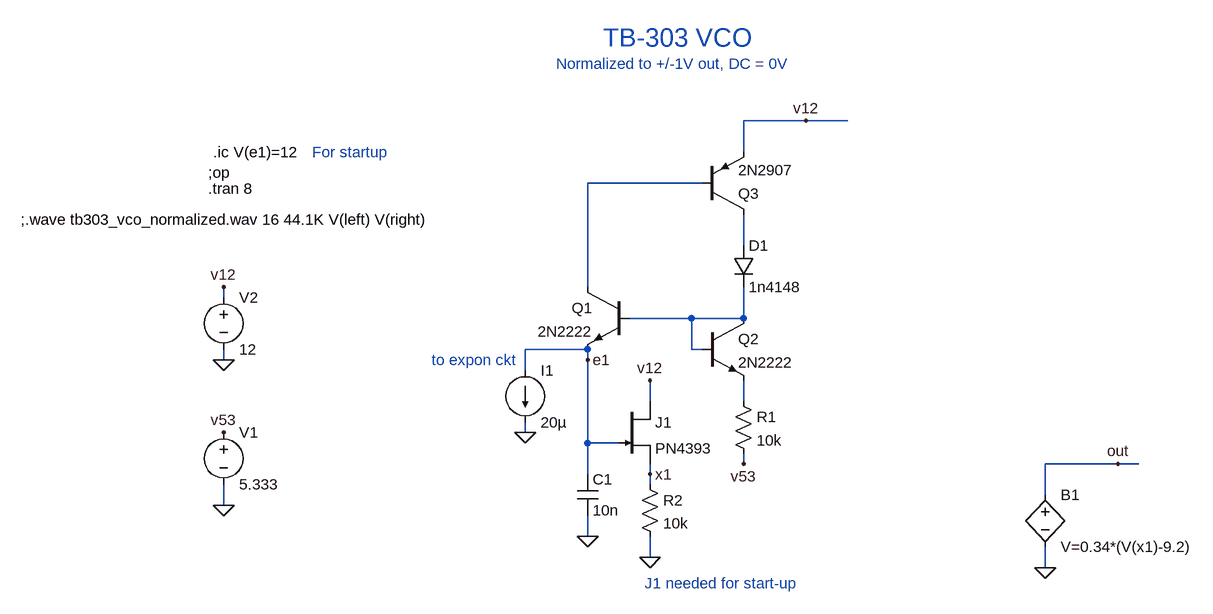
[diagram p0: schematic tb303_vco_normalized.asc]
tb303_vco_normalized.asc, the LTspice schematic file:
Version 4
SHEET 1 1100 1252
WIRE 432 -176 336 -176
WIRE 496 -176 432 -176
WIRE 336 -128 336 -176
WIRE 272 -80 96 -80
WIRE 336 16 336 -32
WIRE 96 80 96 -80
WIRE -464 96 -464 80
WIRE 256 128 160 128
WIRE 336 128 336 80
WIRE 336 128 256 128
WIRE 96 176 0 176
WIRE 256 176 256 128
WIRE 272 176 256 176
WIRE -464 192 -464 176
WIRE 96 192 96 176
WIRE 0 208 0 176
WIRE 192 256 192 224
WIRE 336 256 336 224
WIRE 0 304 0 288
WIRE 96 320 96 192
WIRE 144 320 96 320
WIRE 336 352 336 336
WIRE 912 352 800 352
WIRE 944 352 912 352
WIRE 96 368 96 320
WIRE 192 368 192 352
WIRE 192 384 192 368
WIRE 800 400 800 352
WIRE -464 416 -464 384
WIRE 96 464 96 432
WIRE 192 496 192 464
WIRE 800 512 800 480
FLAG 0 304 0
FLAG -464 416 0
FLAG -464 192 0
FLAG 96 464 0
FLAG 96 192 e1
FLAG 432 -176 v12
FLAG -464 304 v53
FLAG 192 496 0
FLAG 192 224 v12
FLAG 192 368 x1
FLAG -464 80 v12
FLAG 336 352 v53
FLAG 800 512 0
FLAG 912 352 out
SYMBOL current 0 208 R0
WINDOW 123 0 0 Left 2
WINDOW 39 0 0 Left 2
SYMATTR InstName I1
SYMATTR Value 20µ
SYMBOL npn 160 80 M0
SYMATTR InstName Q1
SYMATTR Value 2N2222
SYMBOL npn 272 128 R0
SYMATTR InstName Q2
SYMATTR Value 2N2222
SYMBOL diode 320 16 R0
SYMATTR InstName D1
SYMATTR Value 1n4148
SYMBOL pnp 272 -32 M180
SYMATTR InstName Q3
SYMATTR Value 2N2907
SYMBOL res 320 240 R0
SYMATTR InstName R1
SYMATTR Value 10k
SYMBOL voltage -464 288 R0
SYMATTR InstName V1
SYMATTR Value 5.333
SYMBOL voltage -464 80 R0
SYMATTR InstName V2
SYMATTR Value 12
SYMBOL cap 80 368 R0
SYMATTR InstName C1
SYMATTR Value 10n
SYMBOL njf 144 256 R0
SYMATTR InstName J1
SYMATTR Value PN4393
SYMBOL res 176 368 R0
SYMATTR InstName R2
SYMATTR Value 10k
SYMBOL bv 800 384 R0
SYMATTR InstName B1
SYMATTR Value V=0.34*(V(x1)-9.2)
TEXT -488 -96 Left 2 !;op
TEXT -488 -72 Left 2 !.tran 8
TEXT -480 -128 Left 2 !.ic V(e1)=12
TEXT -144 192 Left 2 ;to expon ckt
TEXT 120 -304 Left 4 ;TB-303 VCO
TEXT -776 -24 Left 2 !;.wave tb303_vco_normalized.wav 16 44.1K V(left) V(right)
TEXT 184 536 Left 2 ;J1 needed for start-up
TEXT 48 -264 Left 2 ;Normalized to +/-1V out, DC = 0V
TEXT -328 -128 Left 2 ;For startup

The netlist it stands for:
* tb303_vco_normalized.asc
I1 e1 0 20µ
Q1 N001 N003 e1 0 2N2222
Q2 N003 N003 N004 0 2N2222
D1 N002 N003 1n4148
Q3 N002 N001 v12 0 2N2907
R1 N004 v53 10k
V1 v53 0 5.333
V2 v12 0 12
C1 e1 0 10n
J1 v12 e1 x1 PN4393
R2 x1 0 10k
B1 out 0 V=0.34*(V(x1)-9.2)
.model D D
.lib standard.dio
.model NPN NPN
.model PNP PNP
.lib standard.bjt
.model NJF NJF
.model PJF PJF
.lib standard.jft
;op
.tran 8
.ic V(e1)=12
* to expon ckt
* TB-303 VCO
;.wave tb303_vco_normalized.wav 16 44.1K V(left) V(right)
* J1 needed for start-up
* Normalized to +/-1V out, DC = 0V
* For startup
.backanno
.end